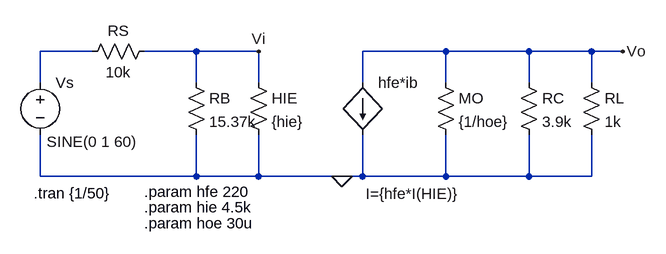
[diagram p0: schematic Modelo_Híbrido_Emisor.asc]
Modelo_Híbrido_Emisor.asc, the LTspice schematic file:
Version 4
SHEET 1 880 680
WIRE 16 96 -64 96
WIRE 176 96 96 96
WIRE 272 96 176 96
WIRE 560 96 432 96
WIRE 688 96 560 96
WIRE 784 96 688 96
WIRE 832 96 784 96
WIRE -64 144 -64 96
WIRE 176 144 176 96
WIRE 272 144 272 96
WIRE 432 144 432 96
WIRE 560 144 560 96
WIRE 688 144 688 96
WIRE 784 144 784 96
WIRE -64 288 -64 224
WIRE 176 288 176 224
WIRE 176 288 -64 288
WIRE 272 288 272 224
WIRE 272 288 176 288
WIRE 400 288 272 288
WIRE 432 288 432 224
WIRE 432 288 400 288
WIRE 560 288 560 224
WIRE 560 288 432 288
WIRE 688 288 688 224
WIRE 688 288 560 288
WIRE 784 288 784 224
WIRE 784 288 688 288
FLAG 832 96 Vo
FLAG 400 288 0
FLAG 272 96 Vi
SYMBOL voltage -64 128 R0
WINDOW 3 10 107 Left 2
WINDOW 123 24 124 Left 2
WINDOW 39 0 0 Left 0
SYMATTR InstName Vs
SYMATTR Value SINE(0 1 60)
SYMBOL res 160 128 R0
SYMATTR InstName RB
SYMATTR Value 15.37k
SYMBOL res 256 128 R0
SYMATTR InstName HIE
SYMATTR Value {hie}
SYMBOL res 112 80 R90
WINDOW 0 0 56 VBottom 2
WINDOW 3 32 56 VTop 2
SYMATTR InstName RS
SYMATTR Value 10k
SYMBOL res 544 128 R0
SYMATTR InstName MO
SYMATTR Value {1/hoe}
SYMBOL res 672 128 R0
SYMATTR InstName RC
SYMATTR Value 3.9k
SYMBOL res 768 128 R0
SYMATTR InstName RL
SYMATTR Value 1k
SYMBOL bi 432 144 R0
WINDOW 3 5 171 Left 2
SYMATTR InstName hfe*ib
SYMATTR Value I={hfe*I(HIE)}
TEXT -74 314 Left 2 !.tran {1/50}
TEXT 96 336 Left 2 !.param hie 4.5k
TEXT 96 360 Left 2 !.param hoe 30u
TEXT 96 312 Left 2 !.param hfe 220

The netlist it stands for:
* Modelo_Híbrido_Emisor.asc
Vs N001 0 SINE(0 1 60)
RB Vi 0 15.37k
R§HIE Vi 0 {hie}
RS Vi N001 10k
R§MO Vo 0 {1/hoe}
RC Vo 0 3.9k
RL Vo 0 1k
B§hfe*ib Vo 0 I={hfe*I(HIE)}
.tran {1/50}
.param hie 4.5k
.param hoe 30u
.param hfe 220
.backanno
.end

* Results of the author's LTspice run, read from the files saved beside the schematic
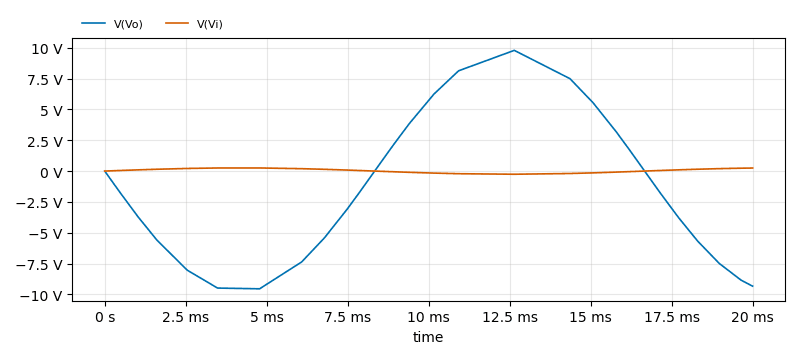
[diagram p1: Transient Analysis of Modelo_Híbrido_Emisor.asc, plotted from the saved traces]
* Transient Analysis, 1 run:
*   V(Vo): min -9.548 V, max 9.789 V, average -922.7 mV, rms 6.715 V, last -9.333 V
*   V(Vi): min -257.6 mV, max 251.2 mV, average 24.28 mV, rms 176.7 mV, last 245.6 mV